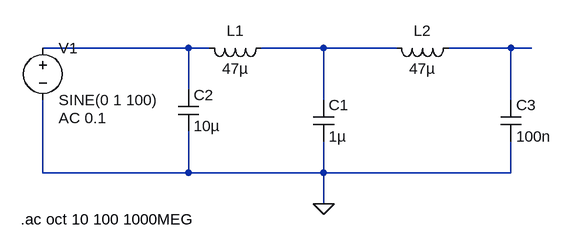
[diagram p0: schematic PI_Filter_SupplyRails.asc]
PI_Filter_SupplyRails.asc, the LTspice schematic file:
Version 4
SHEET 1 880 680
WIRE 256 128 32 128
WIRE 288 128 256 128
WIRE 464 128 368 128
WIRE 576 128 464 128
WIRE 752 128 656 128
WIRE 784 128 752 128
WIRE 256 192 256 128
WIRE 464 208 464 128
WIRE 752 208 752 128
WIRE 32 320 32 208
WIRE 256 320 256 256
WIRE 256 320 32 320
WIRE 464 320 464 272
WIRE 464 320 256 320
WIRE 752 320 752 272
WIRE 752 320 464 320
WIRE 464 368 464 320
FLAG 464 368 0
SYMBOL ind 384 112 R90
WINDOW 0 5 56 VBottom 2
WINDOW 3 32 56 VTop 2
SYMATTR InstName L1
SYMATTR Value 47µ
SYMBOL cap 448 208 R0
SYMATTR InstName C1
SYMATTR Value 1µ
SYMBOL voltage 32 112 R0
WINDOW 123 24 124 Left 2
WINDOW 39 0 0 Left 2
SYMATTR InstName V1
SYMATTR Value SINE(0 1 100)
SYMATTR Value2 AC 0.1
SYMBOL cap 240 192 R0
SYMATTR InstName C2
SYMATTR Value 10µ
SYMBOL ind 672 112 R90
WINDOW 0 5 56 VBottom 2
WINDOW 3 32 56 VTop 2
SYMATTR InstName L2
SYMATTR Value 47µ
SYMBOL cap 736 208 R0
SYMATTR InstName C3
SYMATTR Value 100n
TEXT -2 392 Left 2 !.ac oct 10 100 1000MEG

The netlist it stands for:
* PI_Filter_SupplyRails.asc
L1 N002 N001 47µ
C1 N002 0 1µ
V1 N001 0 SINE(0 1 100) AC 0.1
C2 N001 0 10µ
L2 N003 N002 47µ
C3 N003 0 100n
.ac oct 10 100 1000MEG
.backanno
.end